# EAGLE design MKRMotorCarrierV3.0 (EAGLE 9.6.0)

## Sheet 1 of 2
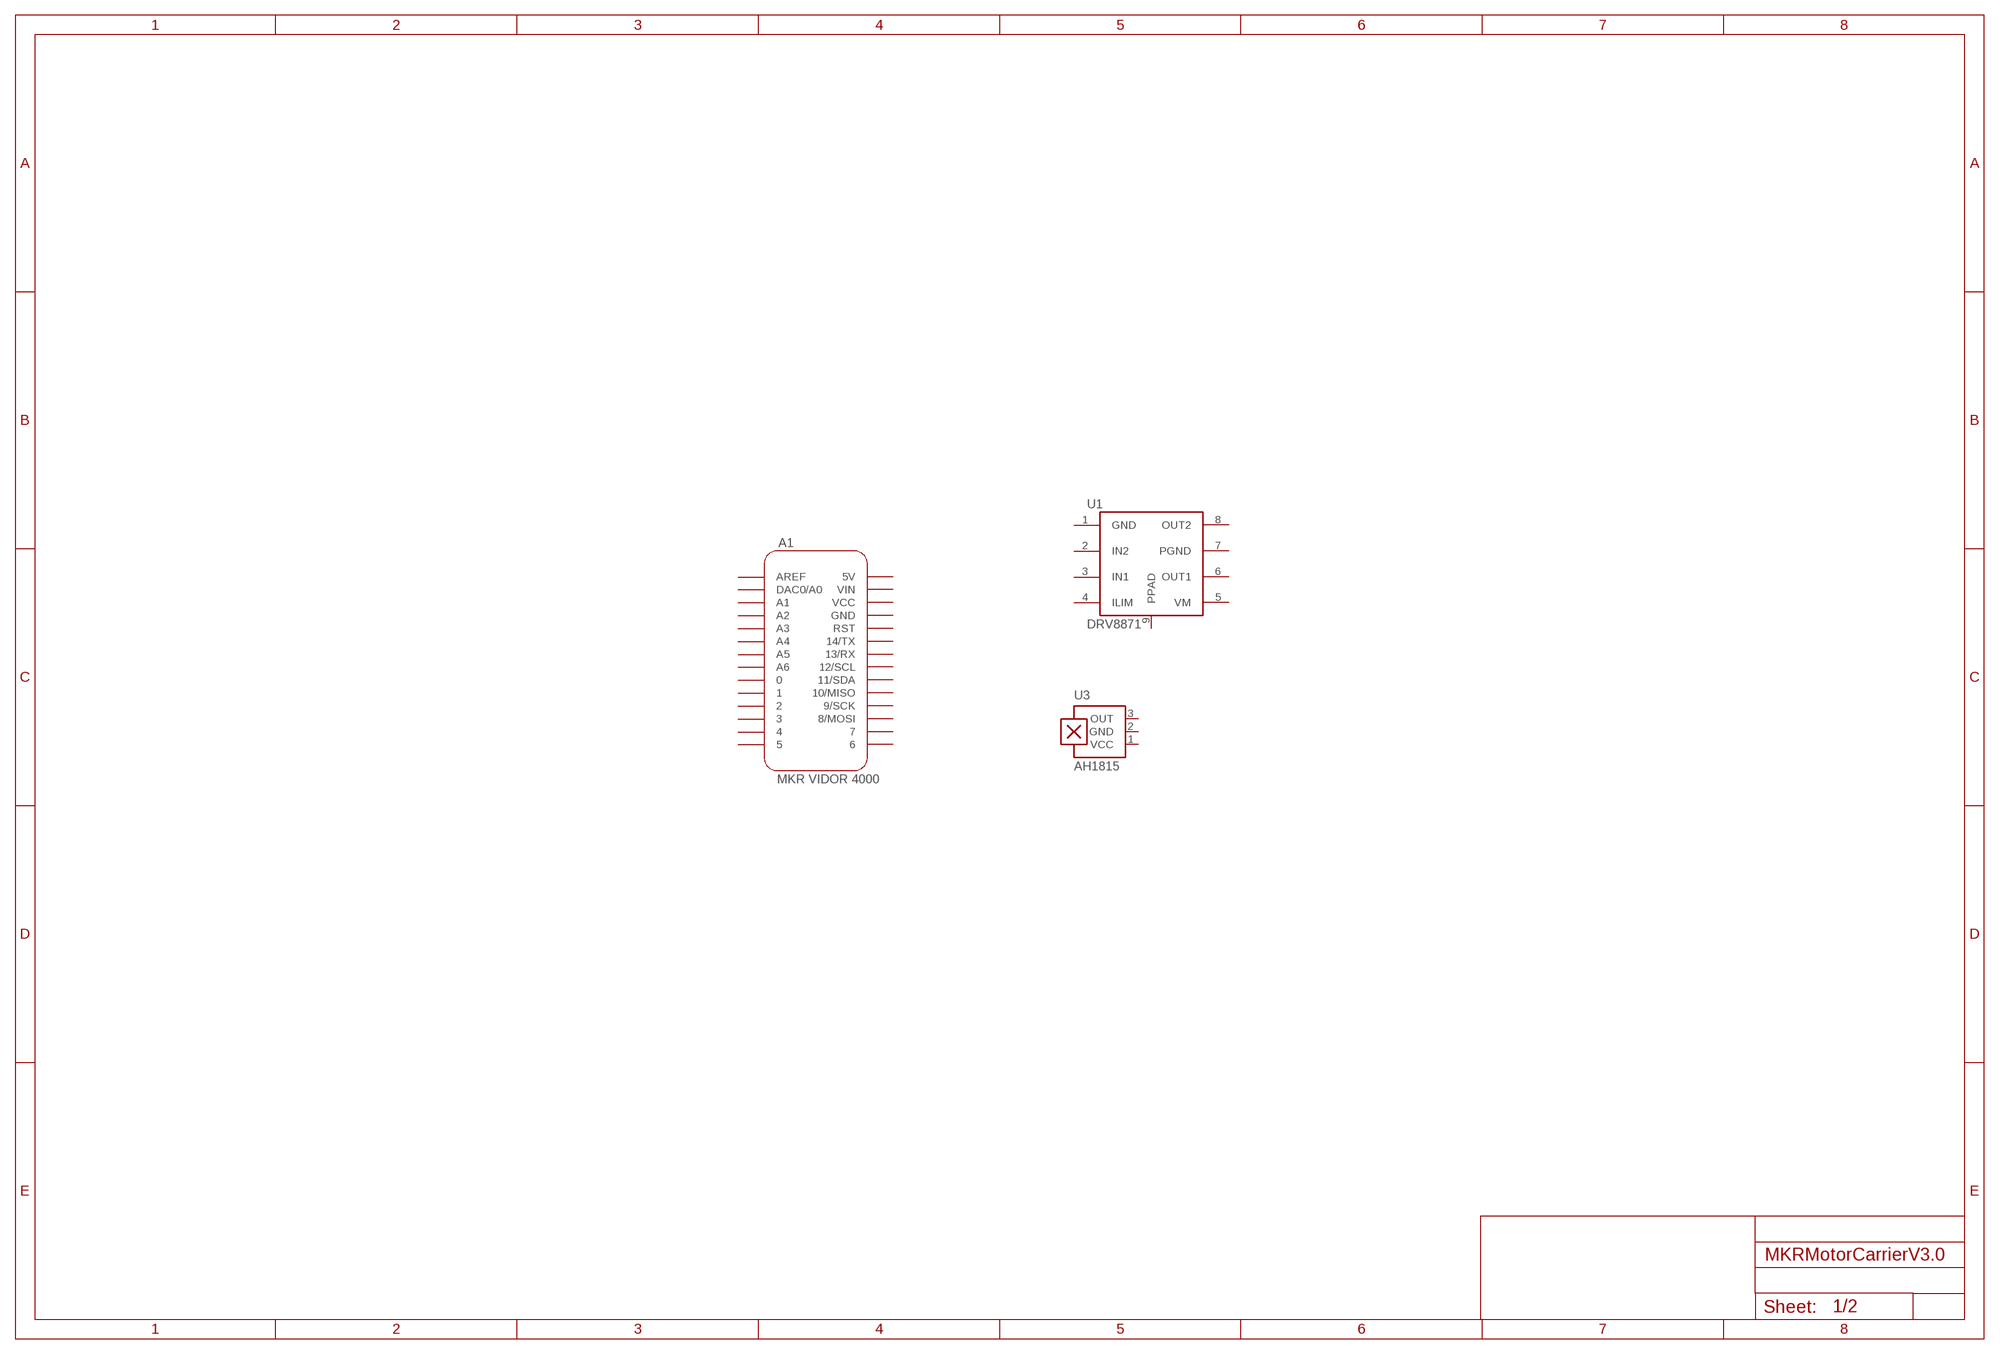
[diagram p0: schematic, sheet 1]

### Parts
A1  MKR VIDOR 4000  BCMI-UTILITY_MKRBOARDOUTLINE  [BCMI-UTILITY_MKRBOARD]
FRAME2  DNP  ARDUINO-UTILITY_A3-FRAME-NO-BAN  [ARDUINO-UTILITY_FRAME-NO-BAN]
U1  DRV8871  [SOIC127P600X170-8N]
U3  AH1815  [SIP3]
Unconnected: A1.0 A1.1 A1.2 A1.3 A1.4 A1.5 A1.5V A1.6 A1.7 A1.8(8/MOSI) A1.9(9/SCK) A1.10(10/MISO) A1.11(11/SDA) A1.12(12/SCL) A1.13(13/RX) A1.14(14/TX) A1.A0(DAC0/A0) A1.A1 A1.A2 A1.A3 A1.A4 A1.A5 A1.A6 A1.AREF A1.GND A1.RST A1.VCC A1.VIN U1.1(GND) U1.2(IN2) U1.3(IN1) U1.4(ILIM) U1.5(VM) U1.6(OUT1) U1.7(PGND) U1.8(OUT2) U1.9(PPAD) U3.3(OUT)

## Sheet 2 of 2
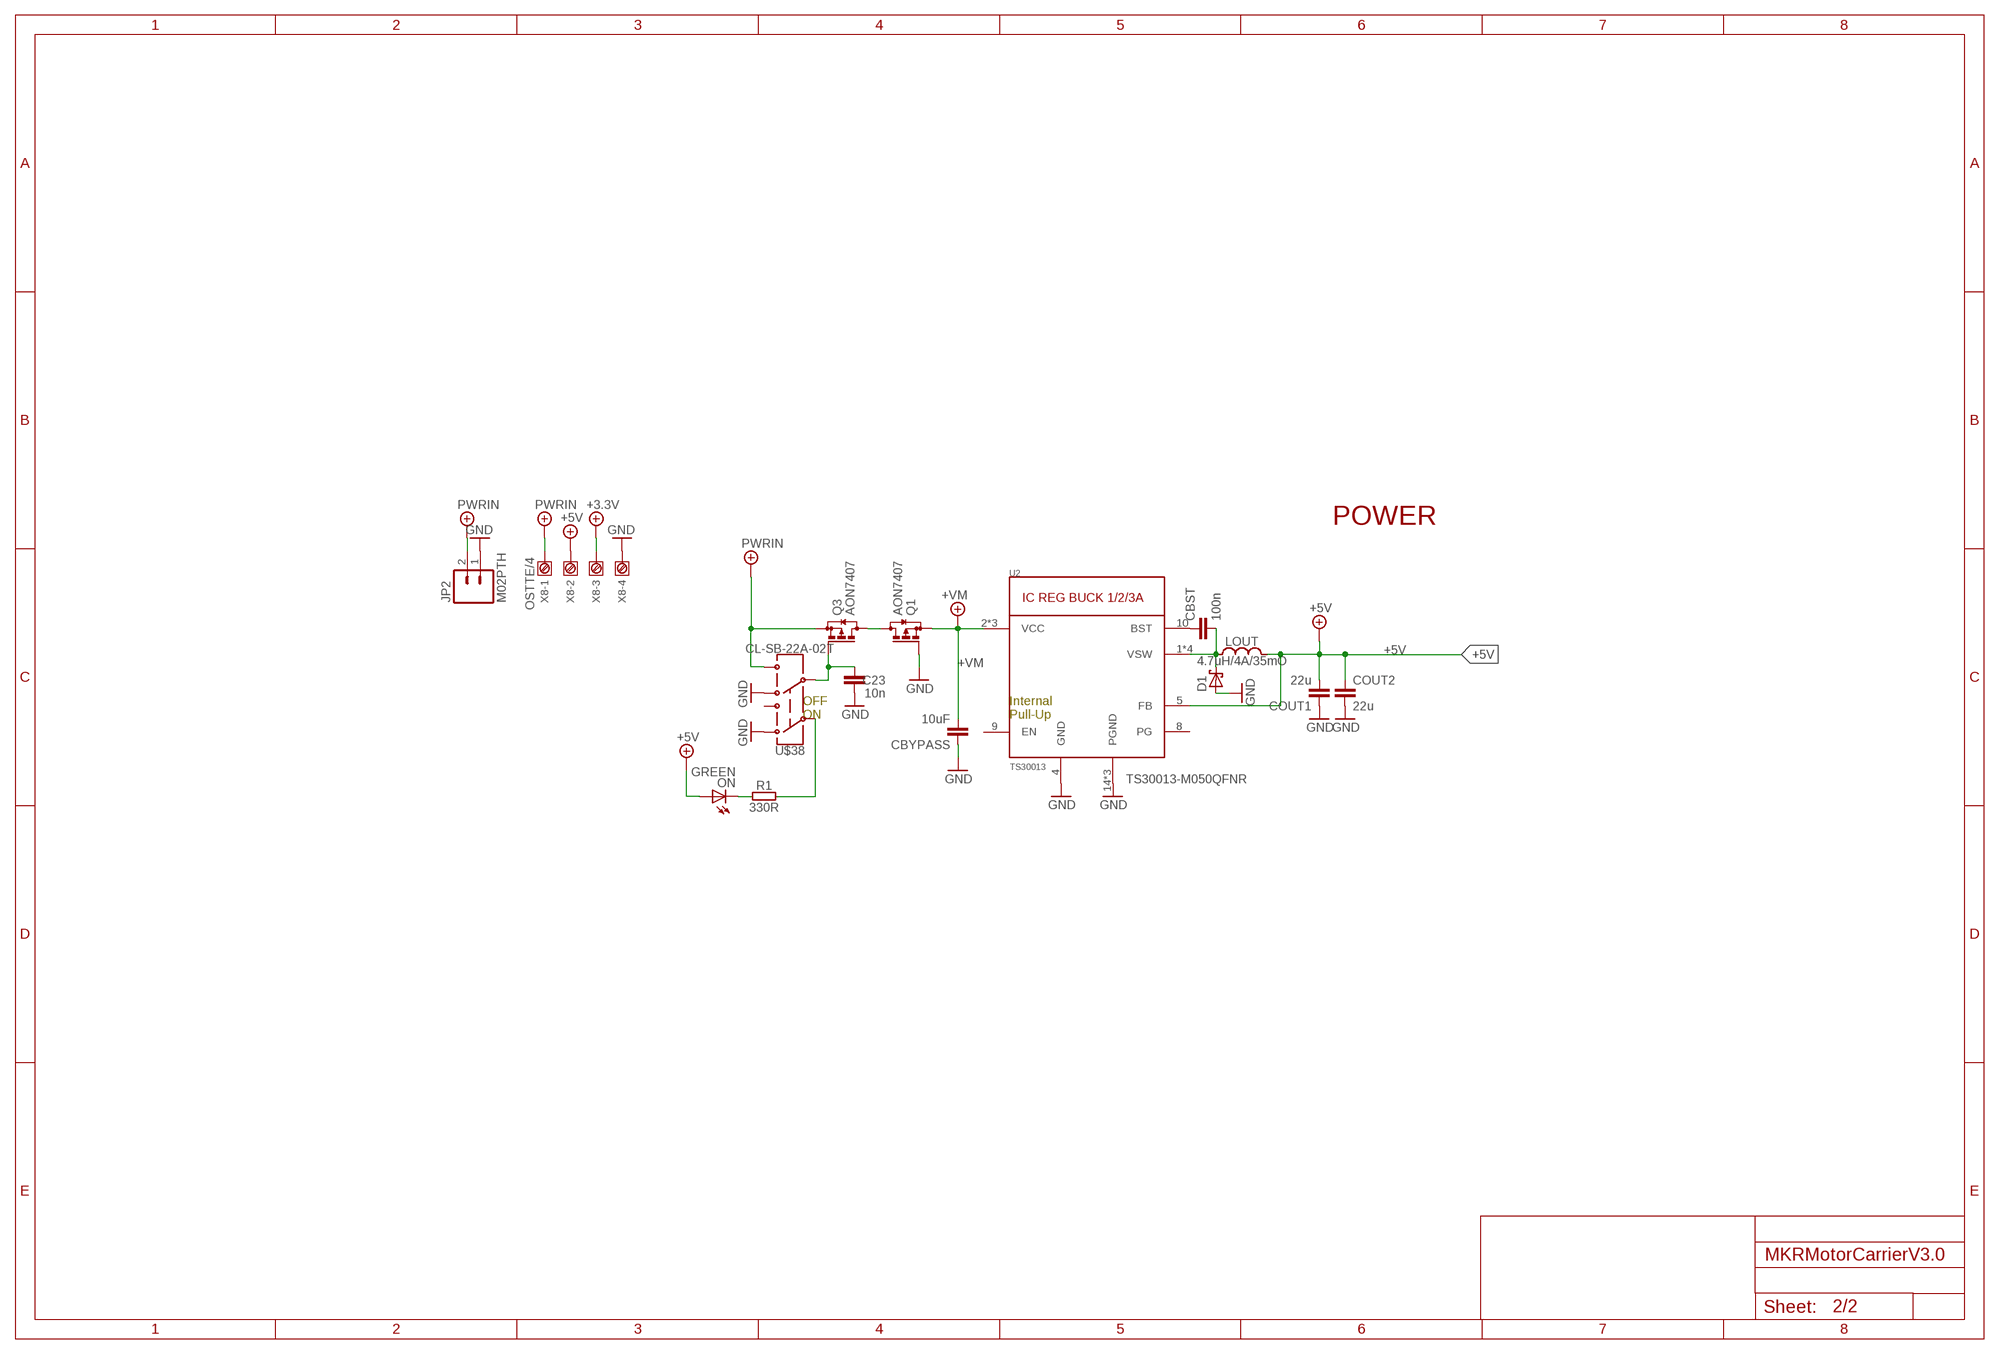
[diagram p1: schematic, sheet 2]

### Parts
C23  10n  C-10NF-0402  [0402-1005X55N]
CBST  100n  C-100NF-0402  [0402-1005X55N]
CBYPASS  10uF  C-10UF-1206  [C1206]
COUT1  22u  C-22U-0805  [0805-R2013X50N]
COUT2  22u  C-22U-0805  [0805-R2013X50N]
D1  40V/5A  D_SCHOTTKY-PMEG4050EP  [SOD-128]
FRAME1  DNP  ARDUINO-UTILITY_A3-FRAME-NO-BAN  [ARDUINO-UTILITY_FRAME-NO-BAN]
JP2  M02PTH  [1X02]
LOUT  4.7uH/4A/35mO  LVLS6045EX-4R7M  [6X6_NON-STANDARD]
ON  GREEN  LED-GREEN-0603  [LEDC1608X80N-AK]
Q1  AON7407  [DFN3X3_8L]
Q3  AON7407  [DFN3X3_8L]
R1  330R  R-330R-0402  [0402-1005X55N]
U2  TS30013  TS3001XTS30013  [QFN16]
U$38  CL-SB-22A-02T  [CL-SB-22A]
X8  OSTTE/4  [OSTTE/4]

### Nets
+3.3V: X8.3
+5V: COUT1.2 COUT2.1 LOUT.P$2 ON.A U2.5(FB) X8.2
+VM: CBYPASS.2 Q1.P$1(S) Q1.P$2(S) Q1.P$3(S) U2.2(VCC) U2.3(VCC) U2.11(VCC)
GND: C23.1 CBYPASS.1 COUT1.1 COUT2.2 D1.P$2(A) JP2.1 Q1.P$4(G) U2.4(GND) U2.14(PGND) U2.15(PGND) U2.17(PGND) U$38.P$1 U$38.P$4 X8.4
N$3: CBST.1 U2.10(BST)
N$5: CBST.2 D1.P$1(C) LOUT.P$1 U2.1(VSW) U2.12(VSW) U2.13(VSW) U2.16(VSW)
N$19: R1.2 U$38.P$2
N$22: Q1.P$5(D) Q1.P$6(D) Q1.P$7(D) Q3.P$5(D) Q3.P$6(D) Q3.P$7(D)
N$23: C23.2 Q3.P$4(G) U$38.P$5
N$133: ON.C R1.1
PWRIN: JP2.2 Q3.P$1(S) Q3.P$2(S) Q3.P$3(S) U$38.P$6 X8.1
Unconnected: U2.8(PG) U2.9(EN) U$38.P$3

### Notes on the sheet
- POWER
- OFF
  ON
- Internal
  Pull-Up
- TS30013-M050QFNR

## Power pins joined to a net without a drawn wire
GND: U3.2(GND)
VCC: U3.1(VCC)

## Library data of the parts
A1 = MKRMotorCarrierV3.0:BCMI-UTILITY_MKRBOARD; DATASHEET: DNP; DISTRIBUTOR-LINK: DNP; DISTRIBUTOR-PN: DNP; MANUFACTURER: DNP; MANUFACTURER-PN: DNP; VALUE: DNP
C23 = Arduino-rcl:C: SMD Capacitor CGA5L3X5R1V106K160AB: CAP CER 10UF 35V X5R 1206; CODE-BCE: -; CODE-BCMI: -; CODE-TK2: -; DATASHEET: http://search.murata.co.jp/Ceramy/image/img/A01X/partnumbering_e_01.pdf; DISTRIBUTOR-LINK: http://www.digikey.com/product-detail/en/murata-electronics-north-america/GRM155R71H103KA88J/490-6351-1-ND/3845548; DISTRIBUTOR-PN: 490-6351-1-ND; MANUFACTURER: Murata; MANUFACTURER-PN: GRM155R71H103KA88J
CBST = Arduino-rcl:C: SMD Capacitor CGA5L3X5R1V106K160AB: CAP CER 10UF 35V X5R 1206; CODE-BCE: -; CODE-BCMI: -; CODE-TK2: -; DATASHEET: http://www.tdk.com/pdf/TDKMLCCCapRange.pdf; DISTRIBUTOR-LINK: http://www.digikey.com/product-detail/en/tdk-corporation/C1005X5R1H104K050BB/445-5942-1-ND/2443982; DISTRIBUTOR-PN: 445-5942-1-ND; MANUFACTURER: TDK; MANUFACTURER-PN: C1005X5R1H104K050BB
CBYPASS = Arduino-rcl:C: SMD Capacitor CGA5L3X5R1V106K160AB: CAP CER 10UF 35V X5R 1206; CODE-BCE: -; CODE-BCMI: -; CODE-TK2: -; DATASHEET: https://product.tdk.com/en/products/common/pdf/mlcc_partnumber_description.pdf; DISTRIBUTOR-LINK: https://www.digikey.se/products/en?keywords=445-14694-1-ND; DISTRIBUTOR-PN: 445-14694-1-ND; MANUFACTURER: TDK Corporation; MANUFACTURER-PN: C3216X5R1V106K160AB
COUT1 COUT2 = BCMI-rcl:C: SMD Capacitor CGA5L3X5R1V106K160AB: CAP CER 10UF 35V X5R 1206; DATASHEET: https://media.digikey.com/pdf/Data%20Sheets/Samsung%20PDFs/CL21A226MQCLQNC_character.pdf; DISTRIBUTOR-LINK: https://www.digikey.com/product-detail/en/samsung-electro-mechanics-america-inc/CL21A226MQCLQNC/1276-2412-1-ND/3890498; DISTRIBUTOR-PN: 1276-2412-1-ND; MANUFACTURER: Samsung; MANUFACTURER-PN: CL21A226MQCLQNC
D1 = Arduino-diodes:D_SCHOTTKY: Schottky Diodes; DATASHEET: https://assets.nexperia.com/documents/data-sheet/PMEG4050EP.pdf; DISTRIBUTOR-LINK: https://www.digikey.se/products/en?keywords=1727-5842-1-ND; DISTRIBUTOR-PN: 1727-5842-1-ND; MANUFACTURER: Nexperia USA Inc.; MANUFACTURER-PN: PMEG4050EP,115
FRAME1 FRAME2 = MKRMotorCarrierV3.0:ARDUINO-UTILITY_A3-FRAME: Schematic frame; CODE-ARDUINO: DNP; DATASHEET: DNP; DISTRIBUTOR-LINK: DNP; DISTRIBUTOR-PN: DNP; MANUFACTURER: DNP; MANUFACTURER-PN: DNP
JP2 = MyLibrary:M02: Standard 2-pin 0.1" header. Use with - straight break away headers ( PRT-00116) - right angle break away headers (PRT-00553) - swiss pins (PRT-00743) - machine pins (PRT-00117) - female headers (PRT-00115) Molex polarized connector foot print use with: PRT-08233 with associated crimp pins and housings. 2.54_SCREWTERM for use with PRT-10571. 3.5mm Screw Terminal footprints for PRT-08084 5mm Screw Terminal footprints for use with PRT-08433
LOUT = Arduino-rcl:L: Inductors; DATASHEET: https://product.tdk.com/info/en/catalog/datasheets/inductor_commercial_power_vls6045ex_en.pdf; DISTRIBUTOR-LINK: https://www.digikey.se/products/en?keywords=445-173055-1-ND; DISTRIBUTOR-PN: 445-173055-1-ND; MANUFACTURER: TDK Corporation; MANUFACTURER-PN: VLS6045EX-4R7M
ON = BCMI-diodes:LED: LED; DATASHEET: http://media.digikey.com/pdf/Data%20Sheets/Avago%20PDFs/HSMz-Czzz.pdf; DISTRIBUTOR-LINK: http://www.digikey.com/product-detail/en/broadcom-limited/HSMG-C190/516-1425-1-ND/637749; DISTRIBUTOR-PN: 516-1425-1-ND; MANUFACTURER: Avago; MANUFACTURER-PN: HSMG-C190
Q1 Q3 = BCMI-transistors:AON7407: MOSFET P-CH 20V 14.5A 8DFN P-Channel Mosfet LEGEND VDS: Voltage Drain-Source ID: Drain Current RDS(ON): Drain-Source On-State Resistance VGS(TH): Gate-Source Threshold Voltage CISS: Drain-Source Input Capacitance SOT-23 Name VDS ID RDS(ON) VGS(TH) CISS Package Order Number AON7407 20V 14.5A mOhm -- pF @ 25V 8DFN_3x3 Digikey; DATASHEET: http://aosmd.com/res/data_sheets/AON7407.pdf; DISTRIBUTOR-LINK: https://www.digikey.se/products/en?keywords=785-1306-1-ND; DISTRIBUTOR-PN: 785-1306-1-ND; MANUFACTURER: Alpha&Omega; MANUFACTURER-PN: AON7407
R1 = Arduino-rcl:R: SMD Resistor; CODE-BCE: -; CODE-BCMI: -; CODE-TK2: -; DATASHEET: www.yageo.com.tw/exep/pages/download/literatures/PYu-R_INT-thick_7.pdf; DISTRIBUTOR-LINK: http://www.digikey.com/product-detail/en/yageo/RC0402FR-07330RL/311-330LRCT-ND/729541; DISTRIBUTOR-PN: 311-330LRCT-ND; MANUFACTURER: Yageo; MANUFACTURER-PN: RC0402FR-07330RL
U1 = MKRMotorCarrierV3.0:DRV8871; DATASHEET: http://www.ti.com/lit/ds/symlink/drv8871.pdf; DESCRIPTION: Motor Driver 3.6A 6.5-45v; DISTRIBUTOR-LINK: https://www.digikey.se/products/en?keywords=296-43024-1-ND; DISTRIBUTOR-PN: 296-43024-1-ND; MANUFACTURER: Texas Instruments; MANUFACTURER-PN: DRV8871DDAR
U2 = Arduino-ICs:TS3001X: TS30011/12/13 Buck Switching Regulator IC Positive Fixed/adjustable 5V 1 Output 1A/2A/3A 16-VFQFN Exposed Pad; DATASHEET: http://www.semtech.com/images/datasheet/ts30011_12_13.pdf; DISTRIBUTOR: Digikey; DISTRIBUTOR-LINK: https://www.digikey.se/products/en?keywords=TS30013-M050QFNRCT-ND; DISTRIBUTOR-PN: TS30013-M050QFNRCT-ND; MANUFACTURER: Semtech Corporation; MANUFACTURER-PN: TS30013-M050QFNR
U3 = MKRMotorCarrierV3.0:AH1815: Linear Hall Effect Sensor ICs
U$38 = BCMI-Switches:CL-SB-22A-02T: Slide Switch DPDT Surface Mount; DATASHEET: https://www.nidec-copal-electronics.com/e/catalog/switch/cl-sb.pdf; DISTRIBUTOR-LINK: https://www.digikey.se/products/en?keywords=563-1339-1-ND; DISTRIBUTOR-PN: 563-1339-1-ND; MANUFACTURER: Copal Electronics; MANUFACTURER-PN: CL-SB-22A-02T
X8 = BCMI-connectors:OSTTE/4: TERM BLOCK 3.5MM VERT 4POS PCB 0.138" (3.50mm) Through Hole 10A 125V 16-26 AWG Blue Screw M2; DATASHEET: http://www.on-shore.com/wp-content/uploads/2015/09/osttexx0161.pdf; DISTRIBUTOR: Digikey; DISTRIBUTOR-LINK: https://www.digikey.se/product-detail/en/on-shore-technology-inc/OSTTE040161/ED2637-ND/614586; DISTRIBUTOR-PN: ED2637-ND; MANUFACTURER: On Shore Technologies; MANUFACTURER-PN: OSTTE040161

## Board
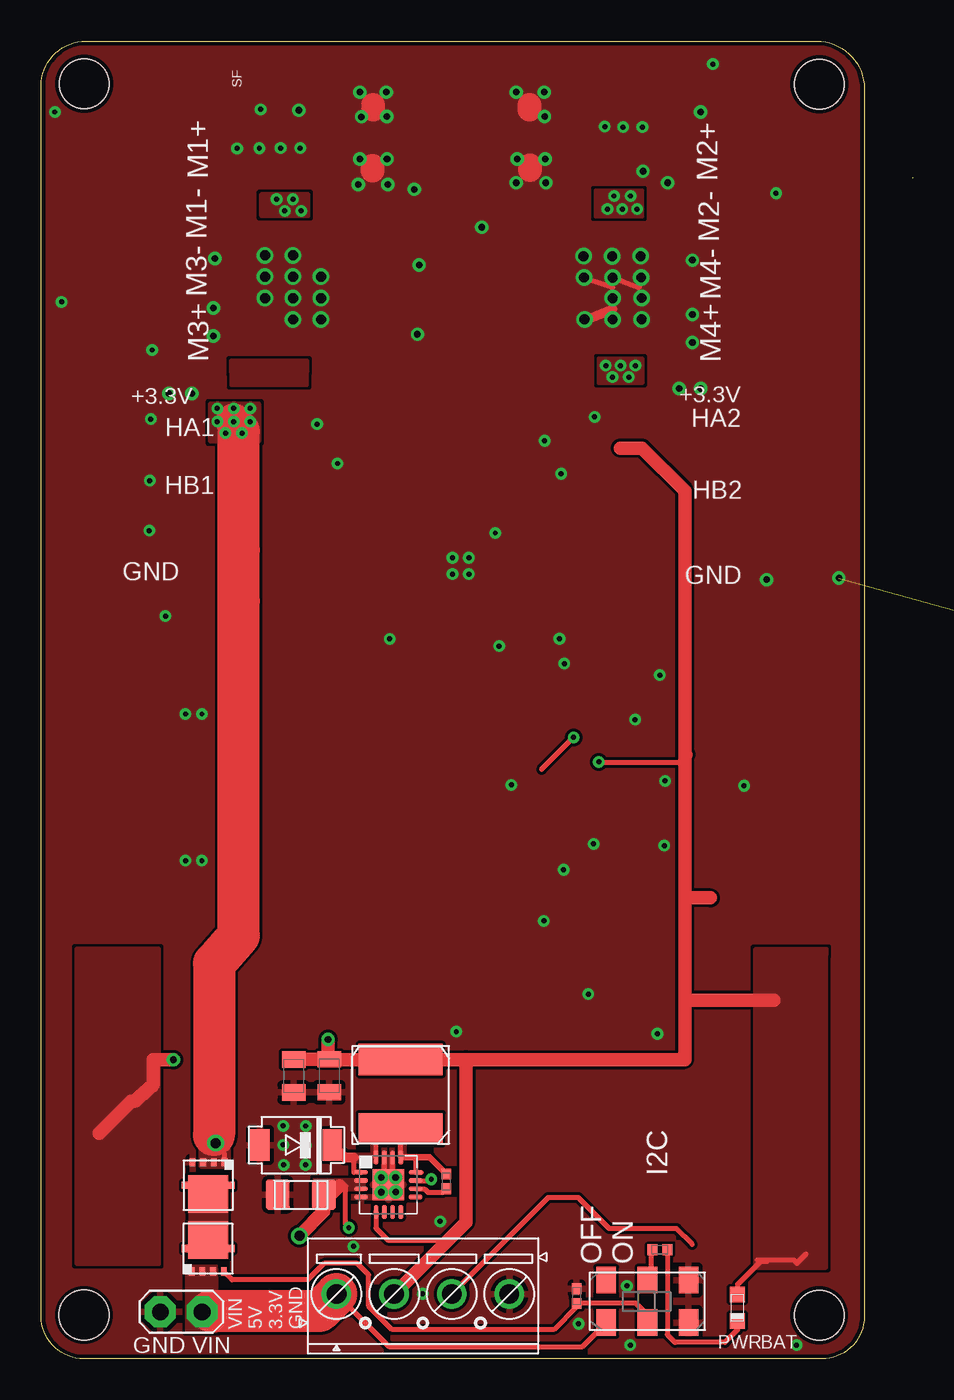
[diagram p2: board, top side]
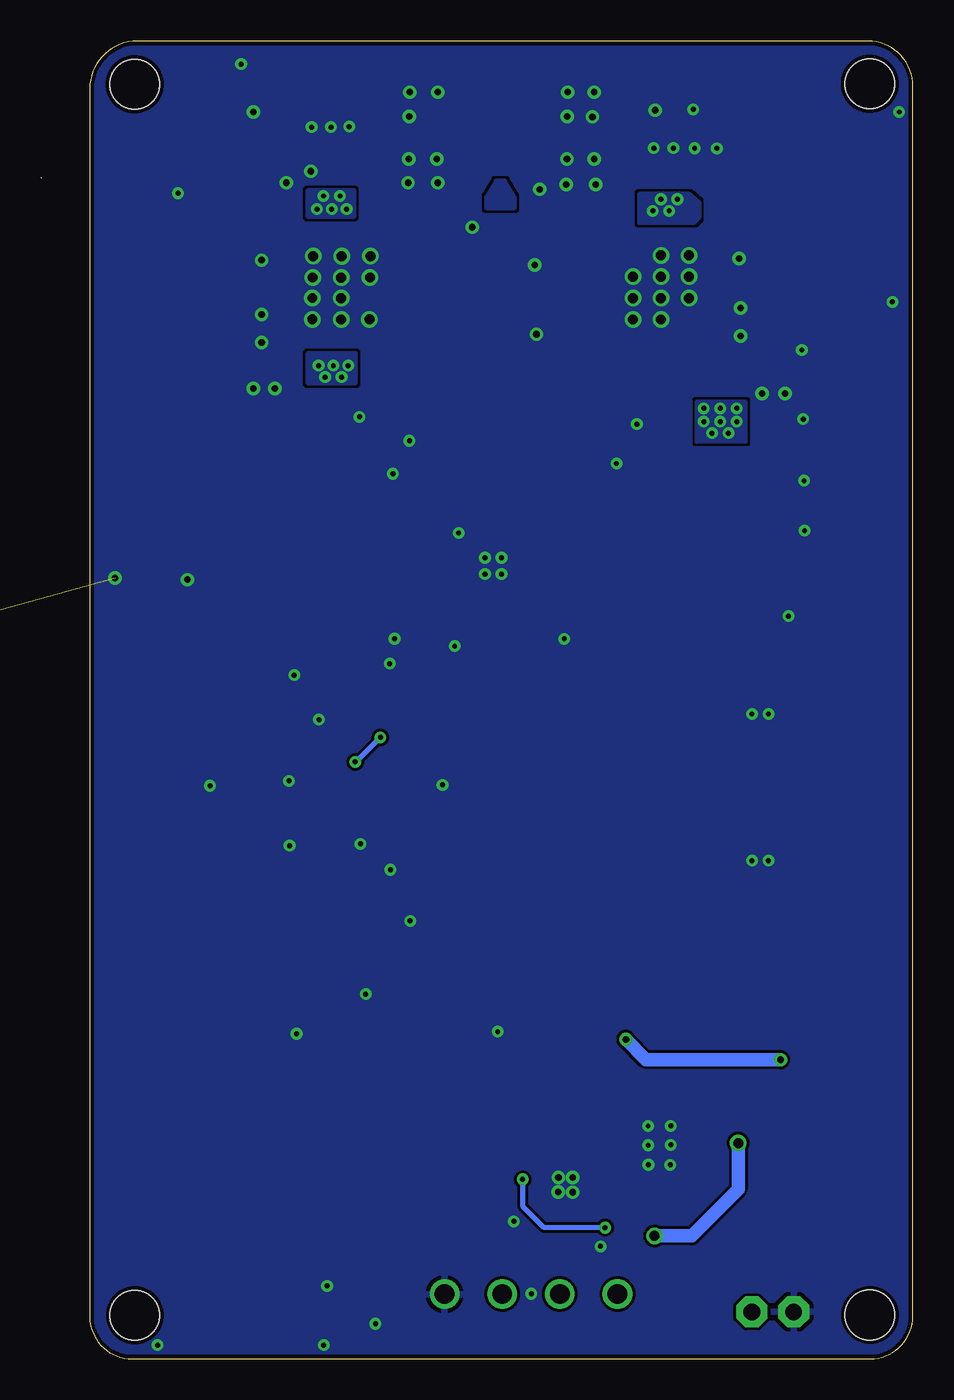
[diagram p3: board, bottom side, seen from below]

Size 52.95 x 80 mm. Coordinates in mm from the lower left corner, seen from the top.
Outline: 52.95,71.7 arc-90 52.95,71.7
Outline: 47.44,0 2.58,0 arc-90 0,2.58 0,77.28 arc-90 2.73,80 47.12,80 arc-90 50,77.12 50,2.56 arc-90 47.44,0
Copper layers (1*16): Top 0.035mm / dielectric 1.5mm / Bottom 0.035mm
Design rules "default *": minimum track width 0.3mm, minimum drill 0.3mm, track to track 7mil, track to pad 7mil, pad to pad 7mil, via to via 7mil, smd to smd 6mil, copper to edge 10mil, drill to drill 10mil, minimum pad ring 10mil, minimum via ring 8mil, stop-mask expansion 0.1mm, vias tented up to drill 0.5mm, thermal gap 10mil
Holes 3 mm at 2.6,2.66 47.26,2.64 47.27,77.39 2.61,77.41

### Footprints (pad centres in the part's own frame; a part is rotated, then mirrored left to right if it is on the bottom)
BCMI-UTILITY_MKRBOARD = drill 0.8 pad 1.524: 0 42.455,2.34; 1 44.995,2.34; 2 47.535,2.34; 3 50.075,2.34; 4 52.615,2.34; 5 55.155,2.34; 5V 22.135,22.66; 7 52.615,22.66; 8 50.075,22.66; 9 47.535,22.66; 10 44.995,22.66; 11 42.455,22.66; 12 39.915,22.66; 13 37.375,22.66; 14 34.835,22.66; A0 24.675,2.34; A1 27.215,2.34; A2 29.755,2.34; A3 32.295,2.34; A4 34.835,2.34; A5 37.375,2.34; A6 39.915,2.34; GND 29.755,22.66; RST 32.295,22.66; VCC 27.215,22.66; VIN 24.675,22.66 | drill 0.8 pad 1.524 square: 6 55.155,22.66; AREF 22.135,2.34 | hole 2.25: 59.25,2.25; 59.25,22.75; 2.25,2.25; 2.25,22.75
0402-1005X55N = smd 0.62 x 0.62: 1 -0.45,0; 2 0.45,0
C1206 = smd 1.8 x 1.45: 1 0,1.4; 2 0,-1.4
0805-R2013X50N = smd 0.95 x 1.45: 1 -1,0; 2 1,0
SOD-128 = smd 1.2 x 1.9: P$1 -2.2,0; P$2 2.2,0
1X02 = drill 1.016 pad 1.88 octagon: 1 0,0; 2 2.54,0
6X6_NON-STANDARD = smd 1.9 x 5.1: P$1 -2.1,0; P$2 2.1,0
LEDC1608X80N-AK = smd 0.9 x 0.95: A 0.8,0; C -0.8,0
DFN3X3_8L = smd 0.5 x 0.35: P$1 -1.4,1.05; P$2 -1.4,0.4; P$3 -1.4,-0.25; P$4 -1.4,-0.9 | smd 2.28 x 2.45: P$5 0.51,0.055 | smd 0.43 x 0.38: P$6 0,1.47; P$7 0,-1.36
SOIC127P600X170-8N = smd 1.97 x 0.6: 1 -2.475,1.905; 2 -2.475,0.635; 3 -2.475,-0.635; 4 -2.475,-1.905; 5 2.475,-1.905; 6 2.475,-0.635; 7 2.475,0.635; 8 2.475,1.905 | smd 2.58 x 3.45: 9 0,0
QFN16 = smd 0.85 x 0.3: 1 -1.655,0.75; 2 -1.655,0.25; 3 -1.655,-0.25; 4 -1.655,-0.75; 9 1.655,-0.75; 10 1.655,-0.25; 11 1.655,0.25; 12 1.655,0.75 | smd 0.3 x 0.85: 5 -0.75,-1.655; 6 -0.25,-1.655; 7 0.25,-1.655; 8 0.75,-1.655; 13 0.75,1.655; 14 0.25,1.655; 15 -0.25,1.655; 16 -0.75,1.655 | smd 1.905 x 1.905: 17 0,0
SIP3 = drill 0.6 pad 0.7 long: 1 -1.27,0; 2 0,0; 3 1.27,0
CL-SB-22A = smd 1.2 x 1.6: P$1 -2.5,-1.29; P$2 0,-1.29; P$3 2.5,-1.29; P$4 -2.5,1.29; P$5 0,1.29; P$6 2.5,1.29
OSTTE/4 = drill 1.2: 1 -5.25,0; 2 -1.75,0; 3 1.75,0; 4 5.25,0

### Placement (x,y rotation side)
A1  5,-50 0 top  (outside the outline)
C23  32.53,3.81 270 top
CBST  24.61,10.77 90 top
CBYPASS  15.77,9.97 90 top
COUT1  17.5,17.19 90 top
COUT2  15.34,17.17 270 top
D1  15.49,12.98 180 top
FRAME1  0,0 0 top
FRAME2  0,0 0 top
JP2  7.24,2.85 0 top
LOUT  21.84,16.07 90 top
ON  42.3,3.1 90 top
Q1  10.09,10.53 270 top
Q3  10.2,6.7 90 top
R1  37.58,6.62 180 top
U1  79,15.1 0 top  (outside the outline)
U2  21.09,10.57 0 top
U3  79.5,38.8 0 top  (outside the outline)
U$38  36.83,3.49 180 top
X8  23.19,3.93 0 top

### Tracks (layer width: path | path; a pad name or v marks a point on that pad's centre or on a via)
+3.3V
  Top 0.305: 39.55,6.95 38.6,7.9 34.51,7.9 32.61,9.8 30.81,9.8 X8.3
+5V  (via drill 0.3, 0.4)
  Top 0.305: U2.5 20.34,7.93 21.07,7.2 24.71,7.2 25,7.5 | v33.87,36.24 33.89,36.22 39.07,36.22 39.1,36.25 | 30.4,35.79 v32.34,37.73 | 46.47,6.37 45.9,5.8 45.7,6 43.5,6 43.6,5.9 44.1,5.9 44,6 43.8,6 42.3,4.5 ON.A
  Top 0.406: 39.11,18.18 39.1,18.17
  Top 0.813: LOUT.P$2 | LOUT.P$2 17.43,18.17 | 15.27,18.17 COUT2.1 15.36,18.19 COUT1.2 17.43,18.17 | LOUT.P$2 25.8,18.17 | 25.8,18.17 39.1,18.17 39.1,21.76 | 39.1,21.76 39.1,27.99 | 39.1,27.99 39.1,36.25 39.1,36.61 | 39.1,36.61 39.1,52.7 36.5,55.3 35.19,55.3 | 39.17,36.68 39.1,36.61 | 3.53,13.71 5.46,15.64 5.69,15.64 6.8,16.65 6.8,18.16 v8.04,18.16 | 44.52,21.76 39.1,21.76 | 40.66,27.99 39.1,27.99 | 17.43,18.17 v17.43,19.39 | 25.8,18.17 25.8,8.29 25,7.5 X8.2
  Bottom 0.305: v33.87,36.24 33.83,36.24 v32.34,37.73
  Bottom 0.813: v8.04,18.16 16.2,18.16 v17.43,19.39
  pour Top: 7.13,24.88 2.16,24.88 2.16,5.8 7.14,5.8
  pour Top: 43.4,24.85 43.4,5.57 47.68,5.57 47.68,24.12 47.7,24.85
+VM  (via drill 0.3, 0.6)
  Top 0.305: Q1.P$1 11.14,12.46 v10.6,13.1 | U2.11 23.62,10.82 v23.7,10.9 | 12.2,48.42 12,49.1 | 12.2,44.93 12,46 | v18.69,7.96 18.5,8.15 18.5,10.5
  Top 0.813: CBYPASS.2 17.35,9.71 18.14,10.5 | 17.09,9.89 CBYPASS.2 | v15.69,7.47 17.17,8.95 CBYPASS.2
  Top 1.27: 10.5,13.6 10.5,13.2 v10.6,13.1
  Top 2.184: 12,56.3 v11.7,56.9
  Top 2.54: 12,56.3 12,49.1 12,46 12,25.7 10.5,24 10.5,13.6
  Bottom 0.305: v18.69,7.96 22.4,7.96 23.67,9.23 23.67,10.87 v23.7,10.9
  Bottom 0.813: v10.6,13.1 10.6,10.3 13.43,7.47 v15.69,7.47
  other vias: 10.7,57.7 11.7,57.7 12.7,57.7 10.7,56.9 12.7,56.9 11.2,56.2 12.2,56.2
  pour Top (no thermals): 9.7,11.7 11.4,11.7 11.4,13.4 9.7,13.4
  pour Top: 13.2,55.7 10.3,55.7 10.3,58 13.2,58
  pour Bottom: 13.1,58.1 10.2,58.1 10.2,55.7 13.1,55.7
  pour Bottom: 24.2,69.9 24.2,70.5 24.8,71.5 25.3,71.5 25.9,70.5 25.9,69.9
  pour Top (no thermals): 19.61,10.85 16.57,10.85 17.8,10.3 19.6,10.3
GND  (via drill 0.3, 0.4, 0.41, 0.6)  (1 unrouted)
  Top 0.305: U2.15 20.84,11.18 v20.66,11.01 | 21.33,12.2 21.33,11.21 v21.53,11.01 v21.52,11.01 | v32.98,65.65 34.71,65.05 v34.72,65.64 36.34,65.04 v36.45,65.65 | 33.14,63.03 33.13,63.03 v33.01,63.11
  Top 0.61: 33.14,63.03 33.18,62.99 33.18,63.11 34.7,63.73 | v33,63.1 v33.01,63.11
  Top 1.422: 29.68,72.46 29.68,72.15 | 29.67,76.15 29.67,75.84 | 20.13,72.45 20.13,72.14 | 20.17,76.15 20.17,75.84
  other vias: 20.66,10.12 21.54,10.12 19.46,75.41 21.01,72.85 20.99,75.42 7.55,45.09 16.07,11.79 25.21,19.87 18.96,6.83 14.73,11.78 14.71,14.14 16.07,14.13 35.78,0.83 23.18,3.95 19.36,72.85 35.59,4.43 6.58,50.28 6.61,53.32 30.58,75.42 28.92,72.84 30.62,72.84 14.71,12.98 32.65,2.13 6.66,57.05 32.95,66.95 34.69,66.94 34.72,64.4 36.48,64.41 36.42,66.95 17,64.4 15.3,65.7 13.6,67 13.6,65.7 13.6,64.4 15.3,64.4 15.3,67 17,65.7 44.64,70.77 1.24,64.17 30.59,55.74 33.62,57.19 28.57,34.85 13.34,75.86 0.83,75.7 6.75,61.25 40.8,78.61 25.98,47.64 14.54,73.51 13.26,73.5 11.9,73.49 15.73,73.51 33.23,22.14 37.9,35.09 16.07,12.96 31.77,42.21 37.85,31.16 30.54,26.59 31.48,43.72 34.23,74.81 35.34,74.78 36.52,74.78 18,54.36 31.59,53.74 24.23,8.34 27.59,50.14 42.7,34.79 15.3,63.1 17,63.1 34.72,63.1 36.48,63.11 28.86,76.91 30.56,76.91 30.66,71.41 19.36,76.91 20.96,76.91 28.86,71.41 15.66,75.81 40.06,75.7 36.56,72.11 19.26,71.31 21.06,71.31 22.96,66.41 22.86,62.2 22.66,71 10.46,62.1 10.46,63.8 9.16,58.6 10.56,66.81 39.56,63.41 39.56,66.7 38.06,71.41 7.76,58.6 38.76,58.91 40.06,58.91 39.56,61.7 26.76,68.7 45.88,0.83 24.98,48.64 25.98,48.64 24.98,47.64 48.46,47.41 44.06,47.3 16.76,56.75 8.77,30.25 9.77,30.25 8.77,39.15 9.77,39.15 31.73,29.69 36.08,38.81 33.55,31.26 21.18,43.71 37.58,41.51 37.44,19.74 27.82,43.27
  pour Top (rank 6): 49.95,79.95 0.46,80.05 arc90 0.2,79.79 -0.13,-1.77 49.92,-1.77
  pour Bottom (rank 6): 0.05,79.8 -0.15,-1.79 48.01,-1.67 arc90 50.01,0.34 49.96,79.93
M3+
  pour Top: 11.55,60.58 11.57,59.15 16.13,59.16 16.14,60.58
M3-  (via drill 0.3)
  Bottom 0.406: 15.97,69.75 15.95,69.75 15.88,69.67 15.82,69.67 v15.8,69.7
  other vias: 14.8,69.7 14.3,70.4 15.3,70.4
  pour Top (no thermals): 13.4,69.4 13.4,70.7 16.2,70.7 16.2,69.4
  pour Bottom: 13,70.2 13.6,70.7 16.6,70.7 16.6,69 13.3,69 13,69.3
M4+  (via drill 0.3)
  other vias: 34.3,60.3 35.2,60.3 36.1,60.3 35.7,59.6 34.7,59.6
  pour Top (no thermals): 33.87,60.7 33.87,59.29 36.51,59.29 36.51,60.7
  pour Bottom: 33.9,61 33.9,59.3 36.7,59.3 36.7,61
M4-  (via drill 0.3)
  other vias: 34.4,69.8 35.3,69.8 36.2,69.8 35.8,70.6 34.8,70.6
  pour Top (no thermals): 33.7,69.4 36.5,69.4 36.5,70.9 33.7,70.9
  pour Bottom: 34,69.4 36.7,69.4 36.7,70.9 34,70.9
N$3
  Top 0.305: U2.10 23.28,10.32 23.5,10.1 24.39,10.1 CBST.1 24.49,10.2
N$5
  Top 0.305: 23.08,11.32 U2.12 22.75,12.22 | U2.1 19,11.32 19,12.22 | 20.34,13.97 LOUT.P$1 U2.13 22,12.22 | U2.16 20.34,13.6 20.8,13.6
  Top 0.406: 22,12.22 22.75,12.22 23.61,12.22 CBST.2
  Top 0.61: D1.P$1 18.45,12.22 19,12.22 | 19.8,13.6 20.8,13.6 21.84,13.6 LOUT.P$1
  pour Top (no thermals): 20.2,12.4 19,12.4 19,12 20.2,12
  pour Top (no thermals): 20.2,13.3 20.1,13.3 20.1,12.1 20.2,12.1
  pour Top (no thermals): 21.9,12.2 22.1,12.2 22.1,13.3 21.9,13.3
N$19
  Top 0.305: 37.04,4.69 U$38.P$2 | U$38.P$2 36.65,4.68 | R1.2 37.03,6.52 37.03,4.98 U$38.P$2
N$22
  Top 0.305: Q1.P$7 9.63,10.53 Q1.P$5 Q1.P$6 | Q3.P$6 Q3.P$5 Q3.P$7
  pour Top (no thermals): 11.06,10.8 9.23,10.8 9.23,7.2 11.07,7.21
N$23
  Top 0.305: 32.72,3.37 C23.2 | C23.2 arc-90 32.77,3.4 36.1,3.4 36.7,2.8 36.7,2.33 U$38.P$5 | Q3.P$4 11.6,4.8 16.2,4.8 17.2,5.8 19.2,5.8 19.9,5.1 19.9,3.2 21.33,1.77 31.14,1.77 32.53,3.16 C23.2
N$133
  Top 0.305: 42.6,2.06 ON.C 42.3,1.76 41.54,1 38.5,1 38.03,1.47 R1.1
PWRIN
  Top 0.305: 33.9,2.2 U$38.P$6 32.87,0.74 21.13,0.74 X8.1
  Top 1.778: 9.97,3.04 JP2.2
  Top 2.54: X8.1 16.91,2.9 10.3,2.9
  pour Top (no thermals): 8.9,5.6 10.6,5.6 10.6,1.7 8.9,1.7

### Text on the board
tPlace: PWR | BAT
tNames: SF | M1+ | M2+ | M1- | M3- | M2- | M3+ | M4- | M4+ | +3.3V | +3.3V | HA2 | HA1 | HB1 | HB2 | GND | GND | I2C | OFF / ON | VIN / 5V / 3.3V / GND | GND VIN